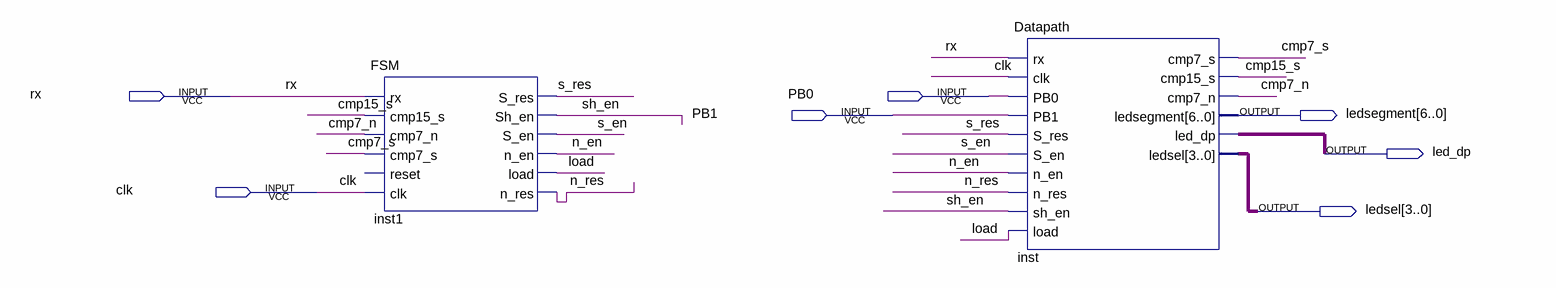
[diagram p0: schematic sheet]
// Quartus schematic VHDL.bdf as structural Verilog: 2 symbols, 7 pins
module VHDL (
  input  rx,
  input  PB0,
  input  PB1,
  input  clk,
  output [6:0] ledsegment,
  output led_dp,
  output [3:0] ledsel
);

  wire cmp7_n, cmp7_s, cmp15_s, load, n_en, n_res, s_en, s_res, sh_en;

  FSM inst1 (
    .rx(rx), .cmp15_s(cmp15_s), .cmp7_n(cmp7_n), .cmp7_s(cmp7_s), .clk(clk), .S_res(s_res), .Sh_en(sh_en),
    .S_en(s_en), .n_en(n_en), .load(load), .n_res(n_res));  // open: reset
  Datapath inst (
    .rx(rx), .clk(clk), .PB0(PB0), .PB1(PB1), .S_res(s_res), .S_en(s_en), .n_en(n_en), .n_res(n_res),
    .sh_en(sh_en), .load(load), .cmp7_s(cmp7_s), .cmp15_s(cmp15_s), .cmp7_n(cmp7_n), .ledsegment(ledsegment),
    .led_dp(led_dp), .ledsel(ledsel));
endmodule
